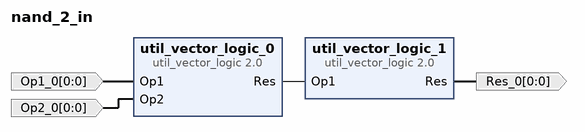
[diagram p0: block diagram of the top level]
# Vivado block design nand_2_in, xc7a100tcsg324-1, Vivado 2021.2
create_bd_design nand_2_in

create_bd_port -dir I -from 0 -to 0 Op1_0
create_bd_port -dir I -from 0 -to 0 Op2_0
create_bd_port -dir O -from 0 -to 0 Res_0

create_bd_cell -type ip -vlnv xilinx.com:ip:util_vector_logic:2.0 util_vector_logic_0
set_property -dict {CONFIG.C_SIZE 1} [get_bd_cells util_vector_logic_0]
create_bd_cell -type ip -vlnv xilinx.com:ip:util_vector_logic:2.0 util_vector_logic_1
set_property -dict {CONFIG.C_OPERATION not CONFIG.C_SIZE 1} [get_bd_cells util_vector_logic_1]

# ---- connections ----

connect_bd_net -net Op1_0_1 [get_bd_ports Op1_0] [get_bd_pins util_vector_logic_0/Op1]
connect_bd_net -net Op2_0_1 [get_bd_ports Op2_0] [get_bd_pins util_vector_logic_0/Op2]
connect_bd_net [get_bd_pins util_vector_logic_0/Res] [get_bd_pins util_vector_logic_1/Op1]
connect_bd_net [get_bd_pins util_vector_logic_1/Res] [get_bd_ports Res_0]

validate_bd_design
save_bd_design
